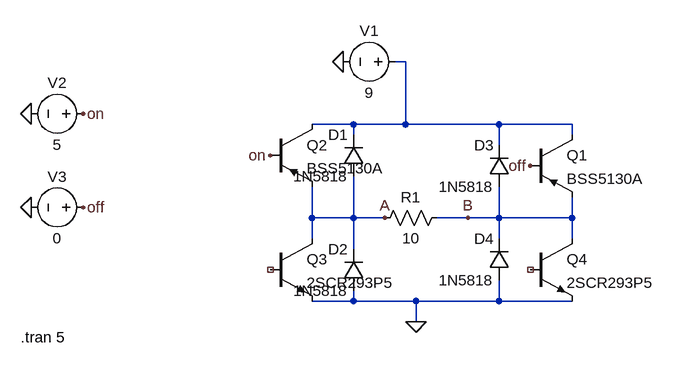
[diagram p0: schematic Hbridge bjt.asc]
Hbridge bjt.asc, the LTspice schematic file:
Version 4.1
SHEET 1 880 680
WIRE 288 -64 272 -64
WIRE 208 32 144 32
WIRE 288 32 288 -64
WIRE 288 32 208 32
WIRE 432 32 288 32
WIRE 544 32 432 32
WIRE 208 48 208 32
WIRE 544 48 544 32
WIRE 432 64 432 32
WIRE 144 176 144 128
WIRE 208 176 208 112
WIRE 208 176 144 176
WIRE 256 176 208 176
WIRE 384 176 336 176
WIRE 432 176 432 128
WIRE 432 176 384 176
WIRE 544 176 544 144
WIRE 544 176 432 176
WIRE 144 208 144 176
WIRE 432 208 432 176
WIRE 544 208 544 176
WIRE 208 224 208 176
WIRE 208 304 208 288
WIRE 208 304 144 304
WIRE 304 304 208 304
WIRE 432 304 432 272
WIRE 432 304 304 304
WIRE 544 304 432 304
WIRE 304 336 304 304
FLAG 256 176 A
FLAG 384 176 B
FLAG 192 -64 0
FLAG 304 336 0
FLAG -288 16 0
FLAG -208 16 on
FLAG -288 160 0
FLAG -208 160 off
FLAG 80 80 on
FLAG 480 96 off
SYMBOL voltage 288 -64 R90
WINDOW 0 -32 56 VBottom 2
WINDOW 3 32 56 VTop 2
WINDOW 123 0 0 Left 0
WINDOW 39 0 0 Left 0
SYMATTR InstName V1
SYMATTR Value 9
SYMBOL voltage -192 16 R90
WINDOW 0 -32 56 VBottom 2
WINDOW 3 32 56 VTop 2
WINDOW 123 0 0 Left 0
WINDOW 39 0 0 Left 0
SYMATTR InstName V2
SYMATTR Value 5
SYMBOL voltage -192 160 R90
WINDOW 0 -32 56 VBottom 2
WINDOW 3 32 56 VTop 2
WINDOW 123 0 0 Left 0
WINDOW 39 0 0 Left 0
SYMATTR InstName V3
SYMATTR Value 0
SYMBOL res 352 160 R90
WINDOW 0 0 56 VBottom 2
WINDOW 3 32 56 VTop 2
SYMATTR InstName R1
SYMATTR Value 10
SYMBOL diode 224 112 R180
WINDOW 0 24 64 Left 2
WINDOW 3 24 0 Left 2
SYMATTR InstName D1
SYMATTR Value 1N5818
SYMBOL diode 224 288 R180
WINDOW 0 24 64 Left 2
WINDOW 3 24 0 Left 2
SYMATTR InstName D2
SYMATTR Value 1N5818
SYMBOL diode 448 128 R180
WINDOW 0 24 64 Left 2
WINDOW 3 24 0 Left 2
SYMATTR InstName D3
SYMATTR Value 1N5818
SYMBOL diode 448 272 R180
WINDOW 0 24 64 Left 2
WINDOW 3 24 0 Left 2
SYMATTR InstName D4
SYMATTR Value 1N5818
SYMBOL pnp 480 48 R0
SYMATTR InstName Q1
SYMATTR Value BSS5130A
SYMBOL pnp 80 32 R0
SYMATTR InstName Q2
SYMATTR Value BSS5130A
SYMBOL npn 80 208 R0
SYMATTR InstName Q3
SYMATTR Value 2SCR293P5
SYMBOL npn 480 208 R0
SYMATTR InstName Q4
SYMATTR Value 2SCR293P5
TEXT -304 360 Left 2 !.tran 5

The netlist it stands for:
* Hbridge bjt.asc
V1 N001 0 9
V2 on 0 5
V3 off 0 0
R1 B A 10
D1 A N001 1N5818
D2 0 A 1N5818
D3 B N001 1N5818
D4 0 B 1N5818
Q1 N001 off B 0 BSS5130A
Q2 N001 on A 0 BSS5130A
Q3 A NC_01 0 0 2SCR293P5
Q4 B NC_02 0 0 2SCR293P5
.model D D
.lib standard.dio
.model NPN NPN
.model PNP PNP
.lib standard.bjt
.tran 5
.backanno
.end